# EAGLE design SpinMeter (EAGLE 9.6.2)
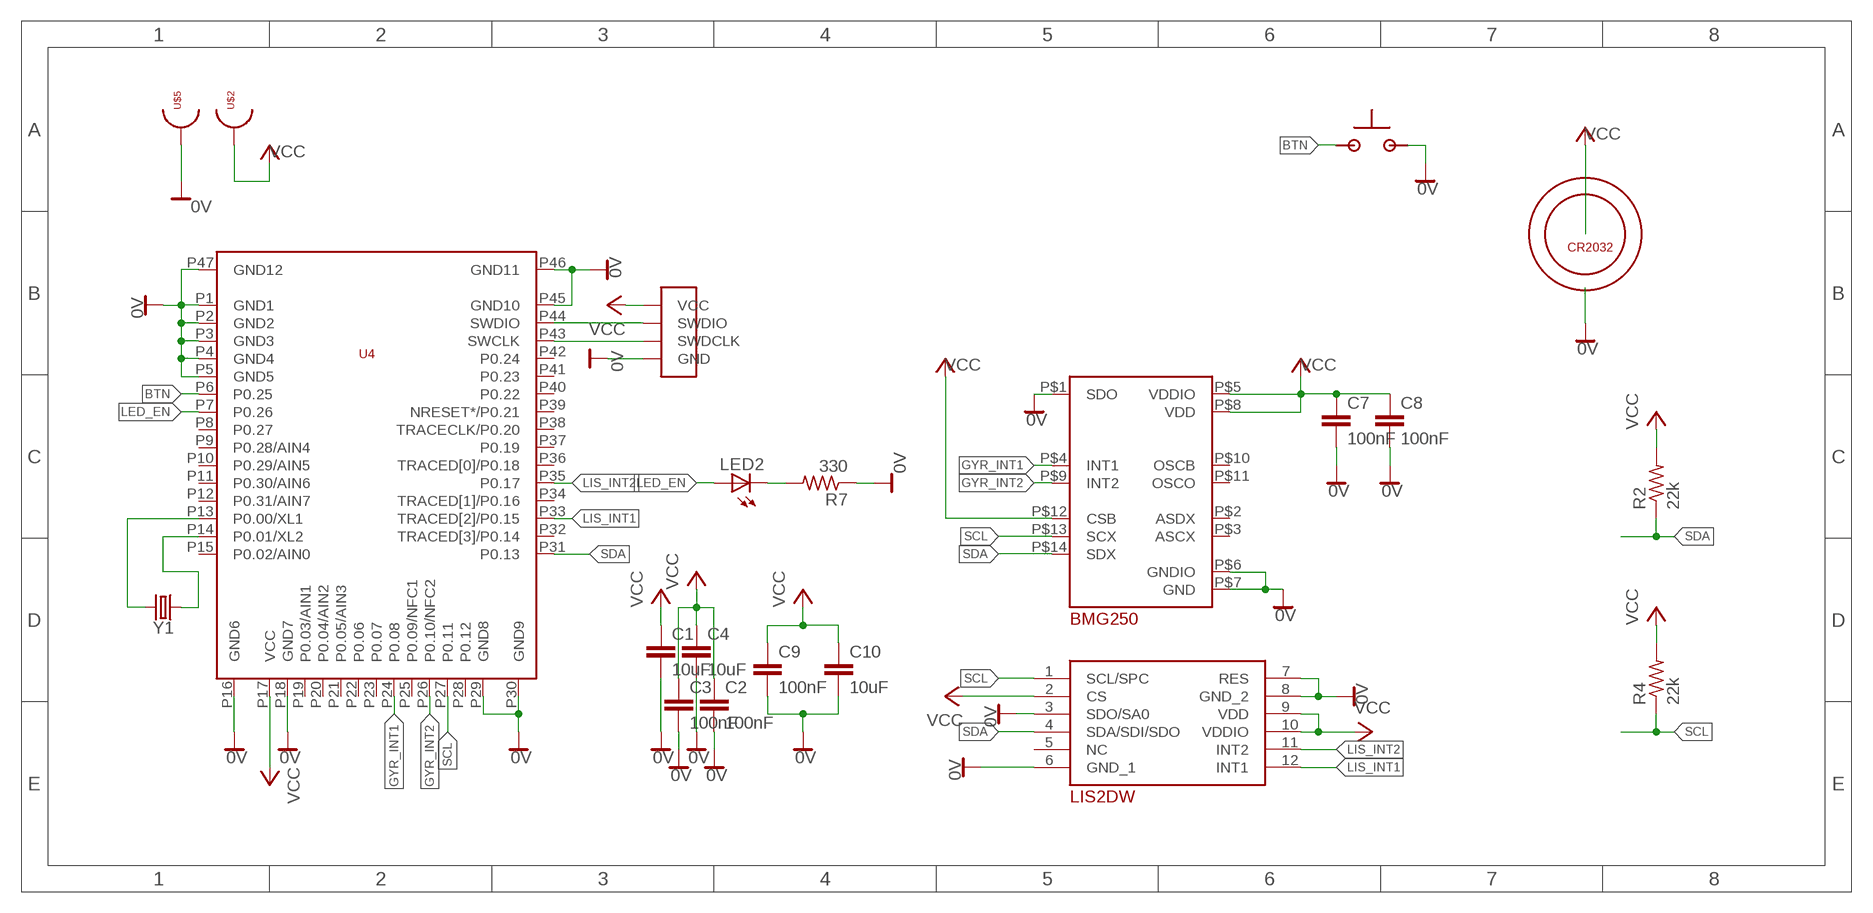
[diagram p0: schematic, sheet 1]

## Parts
C1  10uF  C-EUC0603  [C0603]
C2  100nF  C-EUC0603  [C0603]
C3  100nF  C-EUC0603  [C0603]
C4  10uF  C-EUC0603  [C0603]
C7  100nF  C-EUC0603  [C0603]
C8  100nF  C-EUC0603  [C0603]
C9  100nF  C-EUC0603  [C0603]
C10  10uF  C-EUC0603  [C0603]
IC1  LIS2DW12TR  [LGA-12]
LED2  LEDCHIP-LED0603  [CHIP-LED0603]
R2  22k  R-US_R0603  [R0603]
R4  22k  R-US_R0603  [R0603]
R7  330  R-US_R0603  [R0603]
U1  BMG250  [LGA14]
U3  BAT-HLD-001-THM  [BATHLD001THM]
U4  BMD-300  [BMD-300]
U$1  PROG_SMD  [PROG_SMD]
U$2  TESTPOINT_22  [TESTPOINT_22]
U$5  TESTPOINT_22  [TESTPOINT_22]
U$10  SKRMAAE010  [SKRMAAE010]
Y1  CRYSTALSMD-3.2X1.5  [CRYSTAL-SMD-3.2X1.5MM]

## Nets
0V [PW]: C1.2 C2.2 C3.2 C4.2 C7.2 C8.2 C9.2 C10.2 IC1.3(SDO/SA0) IC1.6(GND_1) IC1.7(RES) IC1.8(GND_2) R7.1 U1.P$1(SDO) U1.P$6(GNDIO) U1.P$7(GND) U3.5(-) U4.P1(GND1) U4.P2(GND2) U4.P3(GND3) U4.P4(GND4) U4.P5(GND5) U4.P16(GND6) U4.P18(GND7) U4.P29(GND8) U4.P30(GND9) U4.P45(GND10) U4.P46(GND11) U4.P47(GND12) U$1.GND U$5.P$1 U$10.P$2 U$10.P$4
BTN: U4.P6(P0.25) U$10.P$1 U$10.P$3
GYR_INT1: U1.P$4(INT1) U4.P24(P0.08)
GYR_INT2: U1.P$9(INT2) U4.P26(P0.10/NFC2)
LED_EN [PW]: LED2.A U4.P7(P0.26)
LIS_INT1: IC1.12(INT1) U4.P33(TRACED[2]/P0.15)
LIS_INT2: IC1.11(INT2) U4.P35(P0.17)
N$3: U4.P44(SWDIO) U$1.PIN2(SWDIO)
N$4: U4.P43(SWCLK) U$1.PIN1(SWDCLK)
N$6 [PW]: LED2.C R7.2
N$7: U4.P13(P0.00/XL1) Y1.P$2
N$8: U4.P14(P0.01/XL2) Y1.P$1
SCL: IC1.1(SCL/SPC) R4.1 U1.P$13(SCX) U4.P27(P0.11)
SDA: IC1.4(SDA/SDI/SDO) R2.1 U1.P$14(SDX) U4.P31(P0.13)
VCC [PW]: C1.1 C2.1 C3.1 C4.1 C7.1 C8.1 C9.1 C10.1 IC1.2(CS) IC1.9(VDD) IC1.10(VDDIO) R2.2 R4.2 U1.P$5(VDDIO) U1.P$8(VDD) U1.P$12(CSB) U3.1(+) U3.2(+) U3.3(+) U3.4(+) U4.P17(VCC) U$1.VCC U$2.P$1
Unconnected: IC1.5(NC) U1.P$2(ASDX) U1.P$3(ASCX) U1.P$10(OSCB) U1.P$11(OSCO) U4.P8(P0.27) U4.P9(P0.28/AIN4) U4.P10(P0.29/AIN5) U4.P11(P0.30/AIN6) U4.P12(P0.31/AIN7) U4.P15(P0.02/AIN0) U4.P19(P0.03/AIN1) U4.P20(P0.04/AIN2) U4.P21(P0.05/AIN3) U4.P22(P0.06) U4.P23(P0.07) U4.P25(P0.09/NFC1) U4.P28(P0.12) U4.P32(TRACED[3]/P0.14) U4.P34(TRACED[1]/P0.16) U4.P36(TRACED[0]/P0.18) U4.P37(P0.19) U4.P38(TRACECLK/P0.20) U4.P39(NRESET*/P0.21) U4.P40(P0.22) U4.P41(P0.23) U4.P42(P0.24)

## Library data of the parts
C1-C4 C7-C10 = rcl:C-EU: CAPACITOR, European symbol; HEIGHT: 0.8
IC1 = Accelerometers:LIS2DW12TR: Accelerometers MEMS digital output motion sensor:high-performance ultra-low-power 3-axis "femto" accelerometer Source: Datasheet <https://componentsearchengine.com/Datasheets/1/LIS2DW12TR.pdf>; DESCRIPTION: Accelerometers MEMS digital output motion sensor:high-performance ultra-low-power 3-axis "femto" accelerometer; HEIGHT: mm; MANUFACTURER_NAME: STMicroelectronics; MANUFACTURER_PART_NUMBER: LIS2DW12TR; MOUSER_PART_NUMBER: 511-LIS2DW12TR; MOUSER_PRICE-STOCK: https://www.mouser.com/Search/Refine.aspx?Keyword=511-LIS2DW12TR
LED2 = adafruit:LED: LED OSRAM: - CHIPLED LG R971, LG N971, LY N971, LG Q971, LY Q971, LO R971, LY R971 LH N974, LH R974 LS Q976, LO Q976, LY Q976 LO Q996 - Hyper CHIPLED LW Q18S LB Q993, LB Q99A, LB R99A - SideLED LS A670, LO A670, LY A670, LG A670, LP A670 LB A673, LV A673, LT A673, LW A673 LH A674 LY A675 LS A676, LA A676, LO A676, LY A676, LW A676 LS A679, LY A679, LG A679 - Hyper Micro SIDELED® LS Y876, LA Y876, LO Y876, LY Y876 LT Y87S - SmartLED LW L88C, LW L88S LB L89C, LB L89S, LG L890 LS L89K, LO L89K, LY L89K LS L896, LA L896, LO L896, LY L896 - TOPLED LS T670, LO T670, LY T670, LG T670, LP T670 LSG T670, LSP T670, LSY T670, LOP T670, LYG T670 LG T671, LOG T671, LSG T671 LB T673, LV T673, LT T673, LW T673 LH T674 LS T676, LA T676, LO T676, LY T676, LB T676, LH T676, LSB T676, LW T676 LB T67C, LV T67C, LT T67C, LS T67K, LO T67K, LY T67K, LW E67C LS E67B, LA E67B, LO E67B, LY E67B, LB E67C, LV E67C, LT E67C LW T67C LS T679, LY T679, LG T679 LS T770, LO T770, LY T770, LG T770, LP T770 LB T773, LV T773, LT T773, LW T773 LH T774 LS E675, LA E675, LY E675, LS T675 LS T776, LA T776, LO T776, LY T776, LB T776 LHGB T686 LT T68C, LB T68C - Hyper Mini TOPLED® LB M676 - Mini TOPLED Santana® LG M470 LS M47K, LO M47K, LY M47K Source: http://www.osram.convergy.de/
R2 R4 R7 = rcl:R-US_: RESISTOR, American symbol; HEIGHT: 0.5
U1 = Gyroscopes:BMG250
U3 = BatteryHolder:BAT-HLD-001-THM: Coin Cell Battery Holders Bat Hld CR2032/2025 Through-hole Mount Source: Datasheet <https://componentsearchengine.com/Datasheets/1/BAT-HLD-001-THM.pdf>; DESCRIPTION: Coin Cell Battery Holders Bat Hld CR2032/2025 Through-hole Mount; HEIGHT: 4.2mm; MANUFACTURER_NAME: Linx Technologies; MANUFACTURER_PART_NUMBER: BAT-HLD-001-THM; MOUSER_PART_NUMBER: 712-BAT-HLD-001-THM; MOUSER_PRICE-STOCK: https://www.mouser.com/Search/Refine.aspx?Keyword=712-BAT-HLD-001-THM
U4 = Rigado:BMD-300
U$1 = Prog:PROG_SMD
U$2 U$5 = test_points:TESTPOINT_22
U$10 = Buttons:SKRMAAE010: Tactile Switches 4.5x4.5x0.4mm 160gf
Y1 = Sparkfun-clocks:CRYSTAL: Crystals (Generic) These are passive quartz crystals, which can be used as a clock source for a microcontroller. Crystal's are two-terminal devices. They require external "load" capacitors to generate an oscillating signal.

## Net classes
0 IO: width 0.152 mm, drill 0.254 mm, clearance 0.152 mm
1 InterD: width 0.152 mm, drill 0.254 mm, clearance 0.635 mm to class 0, clearance 0.635 mm
2 PW: width 0.254 mm, drill 0.254 mm, clearance 0.152 mm to class 0, clearance 0.305 mm to class 1, clearance 0.152 mm

## Board
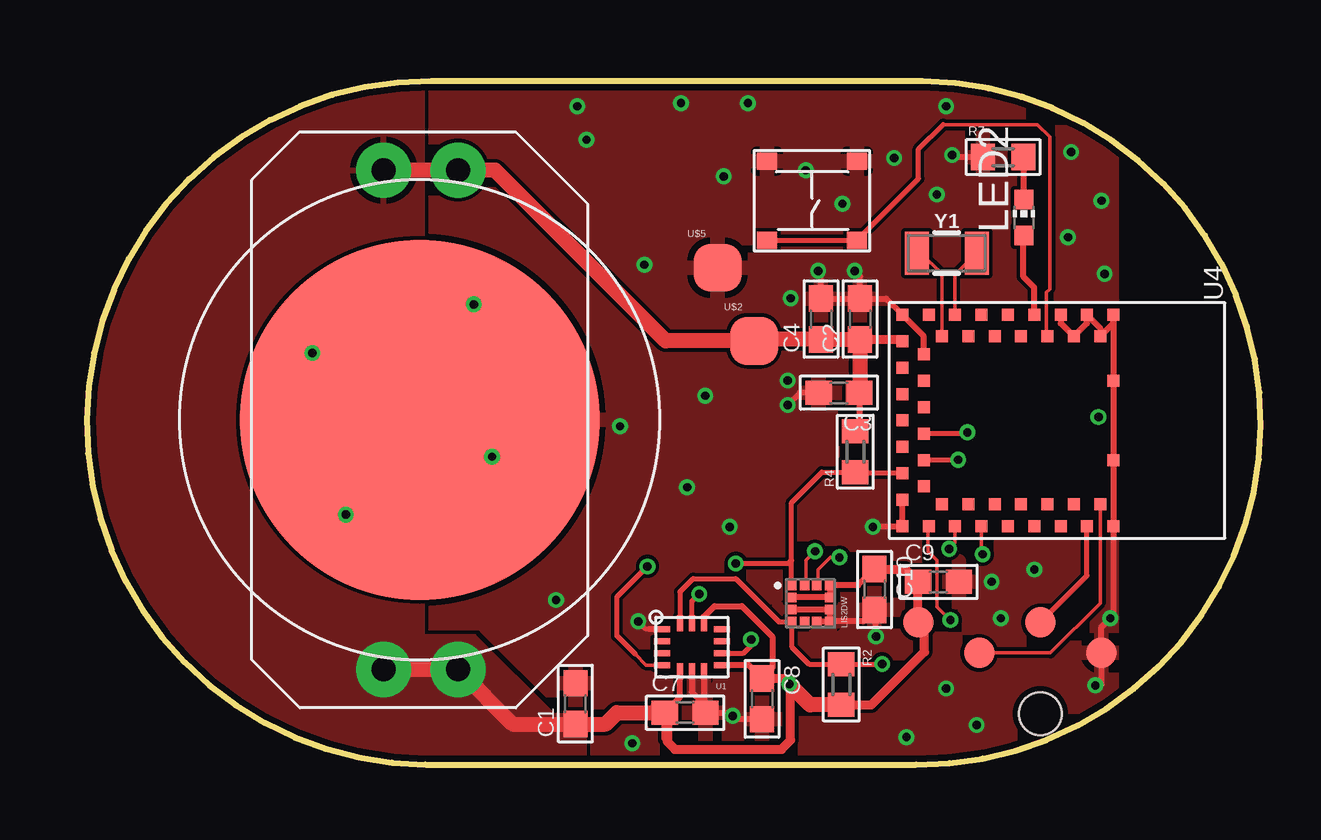
[diagram p1: board, top side]
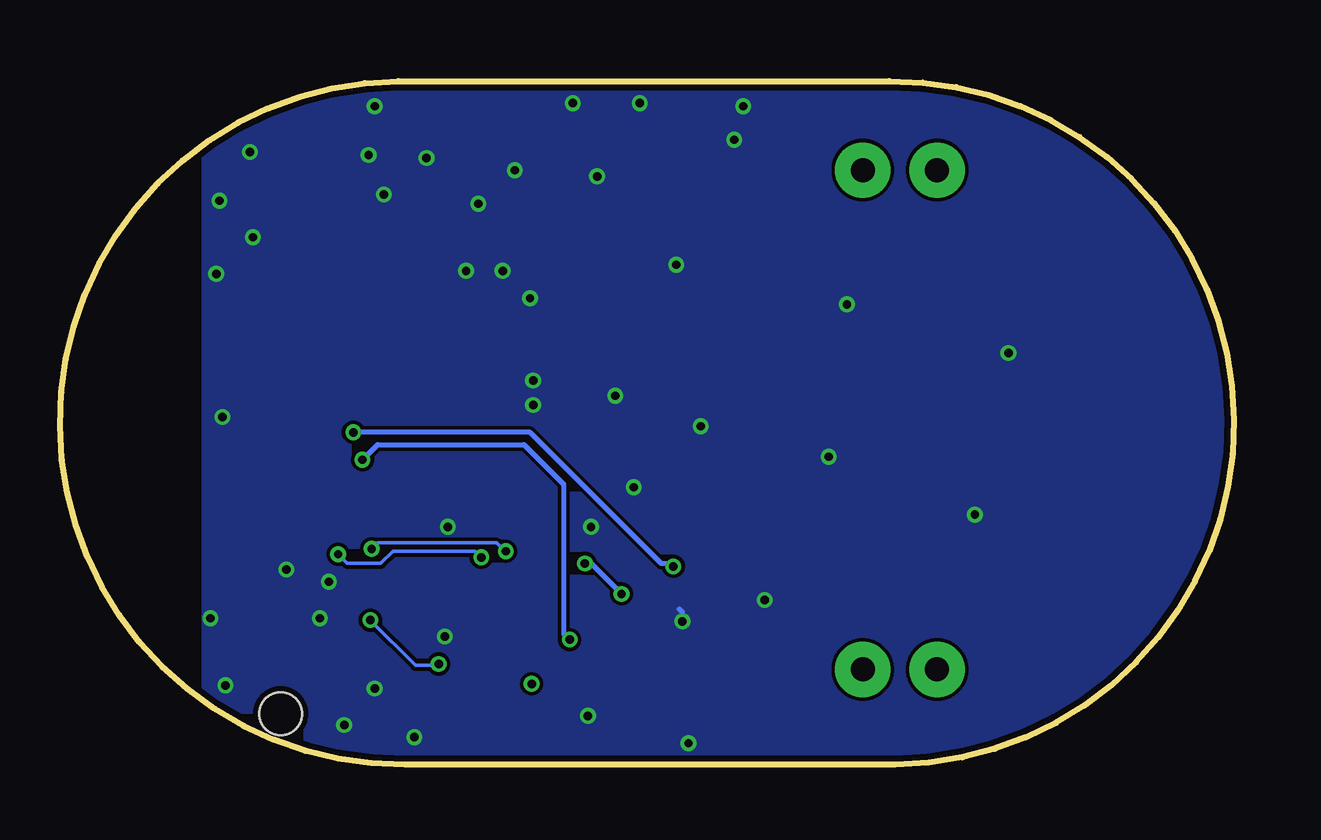
[diagram p2: board, bottom side, seen from below]

Size 48.93 x 28.48 mm. Coordinates in mm from the lower left corner, seen from the top.
Outline: 14.37,28.48 arc180 14.11,0 34.57,0 arc180 34.82,28.48 14.37,28.48
Copper layers (1*16): Top 0.035mm / dielectric 1.5mm / Bottom 0.035mm
Design rules "SeeedStudio_2layer_DRU_no_angle_20140221": minimum track width 6mil, minimum drill 12mil, track to track 6mil, track to pad 6mil, pad to pad 6mil, via to via 6mil, smd to smd 0mil, copper to edge 10mil, drill to drill 10mil, minimum pad ring 10mil, minimum via ring 6mil, stop-mask expansion 2mil, vias tented up to drill 100mil, thermal gap 10mil
tRestrict: area 23.7,3.7 to 26.7,6.1; area 29.2,5.7 to 31.1,7.7; area 33.4,9.4 to 43.3,19.2

### Footprints (pad centres in the part's own frame; a part is rotated, then mirrored left to right if it is on the bottom)
C0603 = smd 1.1 x 1: 1 -0.85,0; 2 0.85,0
LGA-12 = smd 0.4 x 0.4: 1 -0.8,0.75; 2 -0.8,0.25; 3 -0.8,-0.25; 4 -0.8,-0.75; 5 -0.25,-0.75; 6 0.25,-0.75; 7 0.8,-0.75; 8 0.8,-0.25; 9 0.8,0.25; 10 0.8,0.75; 11 0.25,0.75; 12 -0.25,0.75
CHIP-LED0603 = smd 0.8 x 0.8: A 0,-0.75; C 0,0.75
R0603 = smd 1 x 1.1: 1 -0.85,0; 2 0.85,0
LGA14 = smd 0.675 x 0.25: P$1 -1.25,0.75; P$2 -1.25,0.25; P$3 -1.25,-0.25; P$4 -1.25,-0.75; P$8 1.25,-0.75; P$9 1.25,-0.25; P$10 1.25,0.25; P$11 1.25,0.75 | smd 0.25 x 0.675: P$5 -0.5,-1; P$6 0,-1; P$7 0.5,-1; P$12 0.5,1; P$13 0,1; P$14 -0.5,1
BATHLD001THM = drill 1 pad 2.3: 1 -10.4,1.5; 2 -10.4,-1.6; 3 10.4,-1.6; 4 10.4,1.5 | smd 15 x 15: 5 0,0
BMD-300 = smd 0.5 x 0.5: P1 0.5,9.35; P2 1.4,8.8; P3 0.5,8.25; P4 1.4,7.7; P5 0.5,7.15; P6 1.4,6.6; P7 0.5,6.05; P8 1.4,5.5; P9 0.5,4.95; P10 1.4,4.4; P11 0.5,3.85; P12 1.4,3.3; P13 0.5,2.75; P14 1.4,2.2; P15 0.5,1.65; P16 0.5,0.55; P17 1.6,0.55; P18 2.15,1.45; P19 2.7,0.55; P20 3.25,1.45; P21 3.8,0.55; P22 4.35,1.45; P23 4.9,0.55; P24 5.45,1.45; P25 6,0.55; P26 6.55,1.45; P27 7.1,0.55; P28 7.65,1.45; P29 8.2,0.55; P30 9.3,0.55; P31 9.3,1.65; P32 8.4,2.2; P33 9.3,2.75; P34 8.4,3.3; P35 9.3,3.85; P36 8.4,4.4; P37 9.3,4.95; P38 8.4,5.5; P39 9.3,6.05; P40 8.4,6.6; P41 9.3,7.15; P42 8.4,7.7; P43 9.3,8.25; P44 8.4,8.8; P45 9.3,9.35; P46 6.55,9.35; P47 3.25,9.35
PROG_SMD = smd 1.27 x 1.27: GND 3.81,0; PIN1 1.27,1.27; PIN2 -1.27,0; VCC -3.81,1.27 | hole 1.778: 1.27,-2.54
TESTPOINT_22 = smd 2 x 2: P$1 0,0
SKRMAAE010 = smd 0.85 x 0.7: P$1 -1.875,1.65; P$2 -1.875,-1.65; P$3 1.875,1.65; P$4 1.875,-1.65
CRYSTAL-SMD-3.2X1.5MM = smd 1 x 1.8: P$1 -1.25,0; P$2 1.25,0

### Placement (x,y rotation side)
C1  20.37,2.54 90 top
C2  32.23,18.56 90 top
C3  31.35,15.49 180 top
C4  30.61,18.56 90 top
C7  24.94,2.16 0 top
C8  28.15,2.74 270 top
C9  35.5,7.61 0 top
C10  32.83,7.3 270 top
IC1  30.17,6.72 0 top
LED2  39.06,22.8 0 top
R2  31.45,3.34 270 top
R4  32.03,13.03 90 top
R7  38.2,25.31 0 top
U1  25.22,4.89 0 top
U3  13.87,14.37 90 top
U4  33.44,19.24 270 top
U$1  38.47,4.65 0 top
U$2  27.81,17.65 0 top
U$5  26.29,20.7 0 top
U$10  30.23,23.5 180 top
Y1  35.84,21.31 0 top

### Tracks (layer width: path | path; a pad name or v marks a point on that pad's centre or on a via)
0V  (via drill 0.35)
  Top 0.203: 23.44,5.64 23.32,5.64 v22.99,5.97
  Top 0.254: C2.2 C4.2 30.61,20.45 v30.48,20.57 | C2.2 33.32,19.41 U4.P16 34.89,17.84 U4.P18 | U1.P$6 25.22,3.02 26.06,2.18 | U1.P$7 25.72,2.57 26.09,2.21 26.06,2.18 | 26.06,2.18 25.79,1.9 C7.2 26.8,2.16 arc-90 v26.92,2.03 arc90 27.07,1.89 C8.2 | IC1.7 IC1.8 IC1.3 | IC1.7 32.35,5.97 C10.2 32.89,6.39 v32.89,5.33 | v42.04,3.3 42.28,3.3 U$1.GND 42.28,5.71 v42.66,6.1 42.79,6.22 U4.P45 U4.P46 U4.P47 U4.P1 42.79,18.39 U4.P2 42.24,18.19 U4.P3 41.69,18.39 U4.P4 40.59,18.39 U4.P5 | C3.2 29.72,15.49 v29.21,14.99 | v32.77,9.91 33.96,9.91 U4.P30 U4.P29 | C2.2 32.23,20.34 v32,20.57 | R7.1 36.16,25.31 v36.07,25.4 | U1.P$1 23.44,5.64 | IC1.6 IC1.7
  Bottom 0.203: v22.99,5.97 22.99,6.35 23.11,6.48
  other vias: 42.16,14.48 20.45,27.43 24.77,27.56 27.56,27.56 35.81,27.43 41.02,25.53 42.29,23.5 42.42,20.45 33.66,25.27 23.24,20.83 26.54,24.51 31.5,23.37 29.97,24.77 37.72,7.62 39.5,8.13 34.16,1.14 37.08,1.65 35.81,3.17 25.02,11.56 29.21,16 29.34,19.43 22.23,14.1 22.73,0.89 20.83,26.04 38.1,6.1 40.89,21.97 35.43,23.75 26.8,9.91 9.4,17.14 16.13,19.18 16.89,12.83 10.8,10.41 19.56,6.86 25.78,15.37
  pour Bottom (rank 6): -3.81,32 45.21,32 45.21,-4.32 -3.81,-4.32
  pour Top (rank 6): -1.78,32 47.5,32 47.5,-4.32 -1.78,-4.32
BTN
  Top 0.152: 35.69,26.67 39.62,26.67 40.13,26.16 40.13,19.81 40.01,19.68 40.01,17.87 U4.P6
  Top 0.203: U$10.P$3 U$10.P$1 34.67,24.41 34.67,25.65 35.69,26.67
GYR_INT1  (via drill 0.35)
  Top 0.152: U1.P$4 23.32,4.14 22.86,4.6
  Top 0.203: 22.86,4.6 22.1,5.36 22.1,6.98 v23.37,8.25 | v36.7,13.84 36.65,13.79 U4.P24
  Bottom 0.203: v23.37,8.25 23.5,8.38 23.88,8.38 29.34,13.84 v36.7,13.84
GYR_INT2  (via drill 0.35)
  Top 0.203: U1.P$9 27.37,4.64 27.69,4.95 v27.69,5.21 | v36.32,12.7 v36.31,12.69 U4.P26
  Bottom 0.203: v27.69,5.21 27.94,5.46 27.94,11.68 29.59,13.33 35.69,13.33 v36.32,12.7
LED_EN
  Top 0.254: U4.P7 39.49,19.87 39.04,20.32 39.04,22.03 LED2.A
LIS_INT1  (via drill 0.35)
  Top 0.152: IC1.12 29.97,7.52 29.97,8.51 v30.35,8.89 | v35.94,8.99 36.19,9.24 U4.P33
  Bottom 0.152: v30.35,8.89 30.38,8.89 30.74,9.24 35.69,9.24 v35.94,8.99
LIS_INT2  (via drill 0.35)
  Top 0.152: IC1.11 30.48,7.53 30.48,8.13 30.99,8.64 v31.37,8.64 | v37.34,8.76 37.29,8.81 U4.P35
  Bottom 0.152: v31.37,8.64 31.62,8.89 35.05,8.89 35.56,8.38 36.96,8.38 v37.34,8.76
N$3
  Top 0.152: U$1.PIN2 40.16,4.65 42.24,6.73 U4.P44 | U4.P44
N$4
  Top 0.203: U$1.PIN1 41.69,7.88 U4.P43
N$6
  Top 0.254: LED2.C R7.2
N$7
  Top 0.152: U4.P13 36.19,20.41 Y1.P$2
N$8
  Top 0.152: U4.P14 35.64,20.44 34.77,21.31 Y1.P$1
SCL  (via drill 0.35)
  Top 0.203: U4.P27 32.07,12.14 R4.1 30.63,12.18 29.37,10.92 29.37,8.51 | IC1.1 29.37,8.51 | U1.P$13 25.22,6.81 v25.53,7.11 | 29.37,8.51 29.24,8.38 v27.05,8.38
  Bottom 0.203: v27.05,8.38 26.8,8.38 v25.53,7.11
SDA  (via drill 0.35)
  Top 0.152: 29.35,5.95 IC1.4 | v36,6.02 35.43,6.59 35.43,8.51 35.05,8.89 35.05,9.9 U4.P31
  Top 0.203: U1.P$14 24.72,7.2 25.27,7.75 27.05,7.75 28.85,5.95 29.35,5.95 | IC1.4 29.37,4.92 30.1,4.19 R2.1 v33.14,4.19 v33.15,4.19
  Bottom 0.152: v33.15,4.19 33.2,4.14 34.11,4.14 v36,6.02
VCC  (via drill 0.35)
  Top 0.203: R2.2
  Top 0.254: 33.92,17.71 U4.P17 | R4.2 32.2,14.05 C3.1 32.23,15.53 | C10.1 32.15,7.47 IC1.10 IC1.9 IC1.2 | 31.45,2.68 R2.2 | 34.91,5.71 34.91,5.97 34.66,6.22 U$1.VCC | U1.P$5 24.72,2.79 C7.1 24.09,2.03 | U1.P$8 27.6,4.14 C8.1 28.58,4.01 28.58,5.33 27.3,6.6 26.16,6.6 25.72,6.16 U1.P$12 | 24.19,0.95 24.09,1.06 24.09,2.03 | 29.34,3.3 v29.27,3.37 | 23.63,2.49 24.09,2.03
  Top 0.381: C2.1 33.92,17.71 | C7.1 24.19,2.05 24.19,0.95 24.51,0.64 28.96,0.64 29.34,1.02 29.34,3.3 | C8.1 29.05,3.59 v29.27,3.37 | R2.2 32.7,2.49 34.91,4.7 34.91,5.71 | U$1.VCC C9.1 34.11,8.15 C10.1
  Top 0.508: C1.1 20.66,1.4
  Top 0.635: 32.23,15.53 C2.1 C4.1 27.87,17.71 U$2.P$1 24.13,17.65 17.02,24.77 U3.3 U3.4 | C7.1 22.1,2.16 21.63,1.69 C1.1 17.75,1.69 U3.2 U3.1 | R2.2 30.15,2.49 29.34,3.3
  pour Top (rank 2, no thermals): 6.73,5.33 16.13,5.33 19.43,2.03 20.45,2.03 20.7,1.78 20.7,-1.78 20.19,-2.29 6.73,-2.29 5.46,-1.02 5.46,4.06
  pour Top: -0.51,2.67 -0.51,25.78 1.4,27.69 3.18,29.46 13.59,29.46 13.97,29.08 13.97,0.13 12.7,-1.14 3.3,-1.14